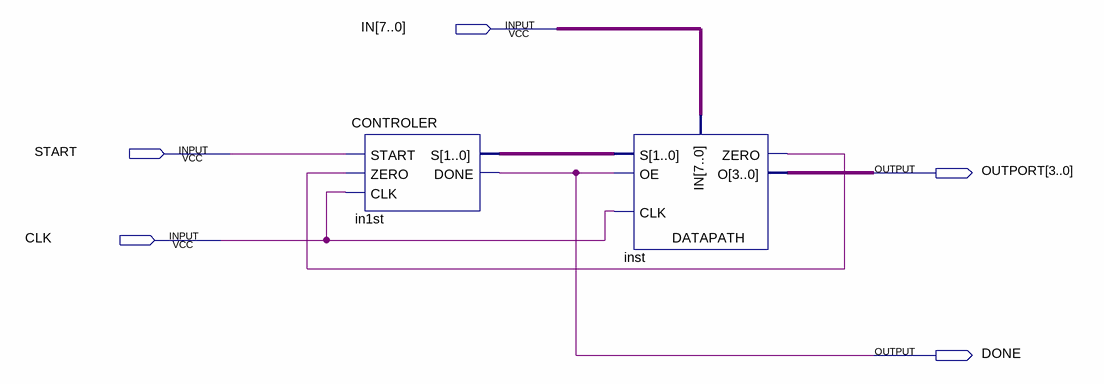
[diagram p0: schematic sheet]
// Quartus schematic DEMBIT1.bdf as structural Verilog: 2 symbols, 5 pins
module DEMBIT1 (
  input  [7:0] IN,
  input  START,
  input  CLK,
  output [3:0] OUTPORT,
  output DONE
);

  wire inst_zero;
  wire [1:0] in1st_s;

  CONTROLER in1st (.START(START), .ZERO(inst_zero), .CLK(CLK), .S(in1st_s), .DONE(DONE));
  DATAPATH inst (.S(in1st_s), .OE(DONE), .IN(IN), .CLK(CLK), .ZERO(inst_zero), .O(OUTPORT));
endmodule
